# Altium schematic sheet escape-room-riddle-box_2020-11-22_15-05-28.schdoc
size 294 x 186 mm
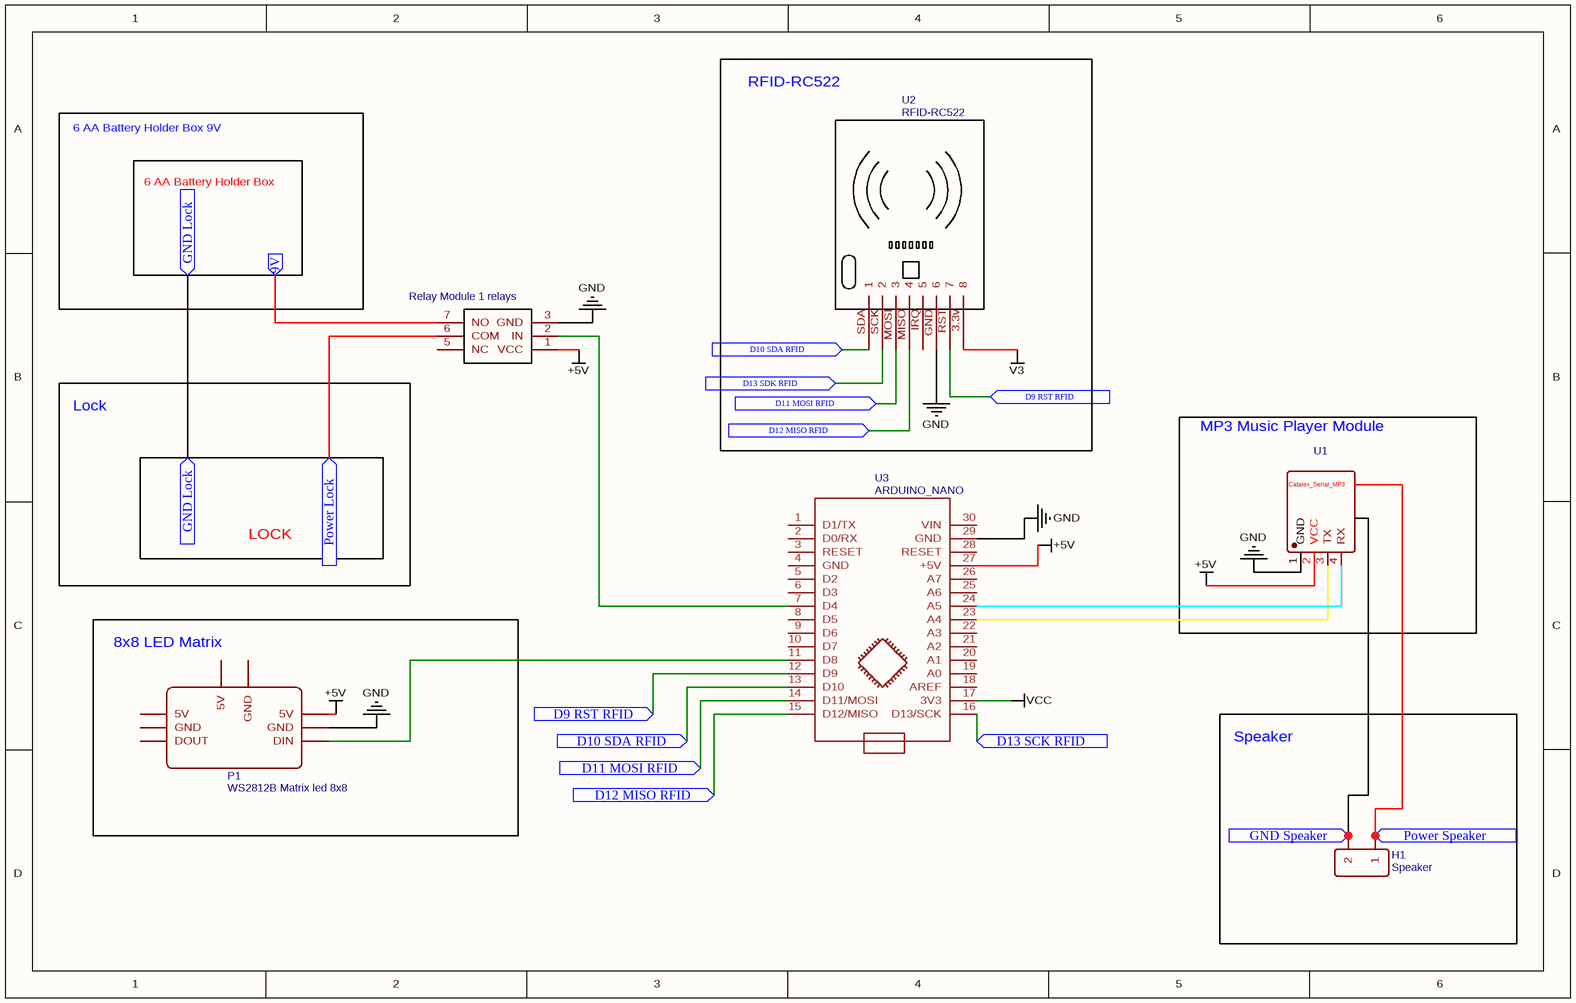
[diagram p0: escape-room-riddle-box_2020-11-22_15-05-28.schdoc]

## Parts
H1  Speaker  [HDR-TH_2P-P2.54-V]
P1  WS2812B Matrix led 8x8  [WS2812B]
U1  Catalex_Serial_MP3  [CATALEX_SERIAL_MP3_PINS]
U2  RFID-RC522
U3  ARDUINO_NANO  [ARDUINO_NANO]
U4  Relay Module 1 relays

## Blocks framed on the sheet
RFID-RC522: U2
MP3 Music Player Module: U1
8x8 LED Matrix: P1
Speaker: H1

## Ports
9V (in), D9 RST RFID (in), D10 SDA RFID (in), D11 MOSI RFID (in), D12 MISO RFID (in), D13 SCK RFID (in), D13 SDK RFID (in), GND Lock (in), GND Speaker (in), Power Lock (in), Power Speaker (in)

## Nets
+5V: P1.3(5V) U1.2(VCC) U3.27(+5V) U4.1(VCC)
GND: P1.2(GND) U1.1(GND) U2.GND(6) U3.29(GND) U4.3(GND)
V3: U2.3.3v(8)
VCC: U3.17(3V3)
9V: U4.7(NO) ; port 9V
D9 RST RFID: U2.RST(7) U3.12(D9) ; port D9 RST RFID
D10 SDA RFID: U2.SDA(1) U3.13(D10) ; port D10 SDA RFID
D11 MOSI RFID: U2.MOSI(3) U3.14(D11/MOSI) ; port D11 MOSI RFID
D12 MISO RFID: U2.MISO(4) U3.15(D12/MISO) ; port D12 MISO RFID
D13 SCK RFID: U3.16(D13/SCK) ; port D13 SCK RFID
D13 SDK RFID: U2.SCK(2) ; port D13 SDK RFID
GND Speaker: H1.2 ; port GND Speaker
Power Lock: U4.6(COM) ; port Power Lock
Power Speaker: H1.1 ; port Power Speaker
NetP1_1: P1.1(DIN) U3.11(D8)
NetU1_3: U1.3(TX) U3.23(A4)
NetU1_4: U1.4(RX) U3.24(A5)
NetU3_7: U3.7(D4) U4.2(IN)

Not connected (* = marked no-connect by the designer): P1 4(DOUT) 5(GND) 6(5V) 7(5V) 8(GND); U2 IRQ(5); U3 1(D1/TX) 2(D0/RX) 3(RESET) 4(GND) 5(D2) 6(D3) 8(D5) 9(D6) 10(D7) 18(AREF) 19(A0) 20(A1) 21(A2) 22(A3) 25(A6) 26(A7) 28(RESET) 30(VIN); U4 5(NC)

## Notes on the sheet
- 6 AA Battery Holder Box 9V
- 6 AA Battery Holder Box
- Lock
- LOCK

## Library data of the parts
H1 = Speaker: BOM_Manufacturer: TE Connectivity; BOM_Manufacturer Part: 826629-2; Contributor: SmartPrototype; BOM_Supplier: LCSC; image: //image.lceda.cn/szlcsc/C86471.jpg; BOM_Supplier Part: C86471; spicePre: H; spiceSymbolName: Header-Male-2.54_1x2
P1 = WS2812B Matrix led 8x8: sourceId: 1T5FDZYC8; Contributor: Flavio Bontà; timeStamp: 1461731208; spicePre: P; spiceSymbolName: WS2812B Matrix led 8x8
U1 = Catalex_Serial_MP3: BOM_Manufacturer Part: Catalex_Serial_MP3_Board; Contributor: davidsamuellevin; BOM_Supplier: DealsExtreme; link: http://www.dx.com/p/uart-control-serial-mp3-music-player-module-for-arduino-avr-arm-pic-blue-silver-342439#.Wut1LdPwbGI; spicePre: U; spiceSymbolName: Catalex_Serial_MP3
U2 = RFID-RC522: BOM_Manufacturer: MFRC522; BOM_Manufacturer Part: NXP; Contributor: dr.mr.beast; BOM_Supplier: LCSC; BOM_Supplier Part: RFID-RC522; link: https://www.nxp.com/docs/en/data-sheet/MFRC522.pdf; spicePre: U; spiceSymbolName: RFID-RC522
U3 = ARDUINO_NANO: sourceId: KGSeAWhDB; timeStamp: 1452340004; spicePre: U; spiceSymbolName: ARDUINO_NANO
U4 = Relay Module 1 relays: Contributor: roman555; BOM_Manufacturer Part: Relay Module 1 relays; spicePre: U; spiceSymbolName: Relay Module 1 relays